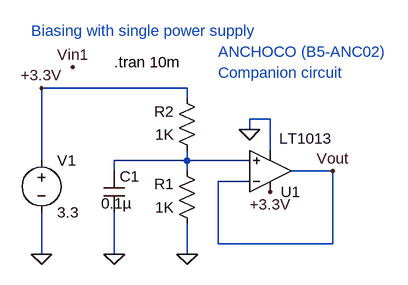
[diagram p0: schematic biasing_with_dual_pow.asc]
biasing_with_dual_pow.asc, the LTspice schematic file:
Version 4
SHEET 1 948 680
WIRE -224 -80 -448 -80
WIRE -224 -64 -224 -80
WIRE -96 -32 -128 -32
WIRE -128 -16 -128 -32
WIRE -96 16 -96 -32
WIRE -448 32 -448 -80
WIRE -224 32 -224 16
WIRE -224 32 -336 32
WIRE -128 32 -224 32
WIRE -336 48 -336 32
WIRE -224 48 -224 32
WIRE 0 48 -64 48
WIRE -128 64 -176 64
WIRE -176 160 -176 64
WIRE 0 160 0 48
WIRE 0 160 -176 160
WIRE -448 176 -448 112
WIRE -336 176 -336 112
WIRE -224 176 -224 128
FLAG -448 176 0
FLAG -448 -80 +3.3V
FLAG -96 80 +3.3V
FLAG 0 48 Vout
FLAG -400 -112 Vin1
FLAG -128 -16 0
FLAG -224 176 0
FLAG -336 176 0
SYMBOL voltage -448 16 R0
WINDOW 123 0 0 Left 0
WINDOW 39 0 0 Left 0
SYMATTR InstName V1
SYMATTR Value 3.3
SYMBOL res -208 32 R180
WINDOW 0 36 76 Left 2
WINDOW 3 36 40 Left 2
SYMATTR InstName R2
SYMATTR Value 1K
SYMBOL res -208 144 R180
WINDOW 0 36 76 Left 2
WINDOW 3 36 40 Left 2
SYMATTR InstName R1
SYMATTR Value 1K
SYMBOL Opamps\\LT1013 -96 112 M180
WINDOW 3 14 114 Left 2
SYMATTR InstName U1
SYMBOL cap -352 48 R0
WINDOW 3 -4 50 Left 2
SYMATTR InstName C1
SYMATTR Value 0.1µ
TEXT -336 -120 Left 2 !.tran 10m
TEXT -464 -168 Left 2 ;Biasing with single power supply
TEXT -176 -136 Left 2 ;ANCHOCO (B5-ANC02)
TEXT -176 -104 Left 2 ;Companion circuit

The netlist it stands for:
* biasing_with_dual_pow.asc
V1 +3.3V 0 3.3
R2 N001 +3.3V 1K
R1 0 N001 1K
XU1 N001 Vout +3.3V 0 Vout LT1013  ; pins In+ In- V+ V- OUT
C1 N001 0 0.1µ
.tran 10m
* Biasing with single power supply
* ANCHOCO (B5-ANC02)
* Companion circuit
.lib LTC.lib
.backanno
.end